# Altium schematic sheet Power_Suply.SchDoc
size A
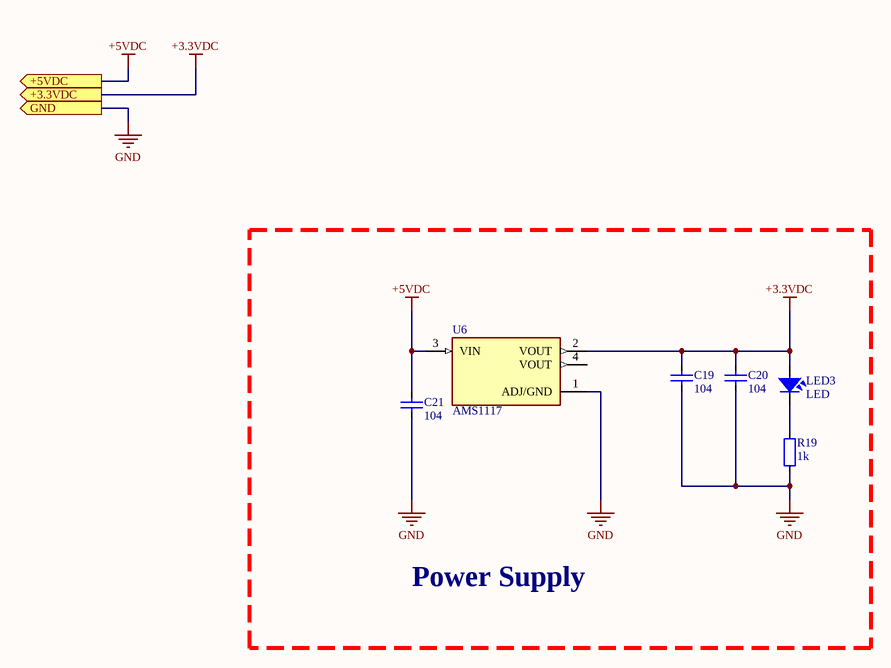
[diagram p0: Power_Suply.SchDoc]

## Parts
C19  104  [CAP_0805]
C20  104  [CAP_0805]
C21  104  [CAP_0805]
LED3  LED  [LED-0805-Red]
R19  1k  [RES-SMD-0805]
U6  AMS1117  [SOT229P700X180-4N]

## Blocks framed on the sheet
Power Supply: C19-C21 LED3 R19 U6

## Ports
+3.3VDC (out), +5VDC (out), GND (out)

## Nets
+3.3VDC: C19.2 C20.2 LED3.1 U6.2(VOUT) ; port +3.3VDC
+5VDC: C21.2 U6.3(VIN) ; port +5VDC
GND: C19.1 C20.1 C21.1 R19.1 U6.1(ADJ/GND) ; port GND
NetLED3_2: LED3.2 R19.2

Not connected (* = marked no-connect by the designer): U6 4(VOUT)

## Library data of the parts
C19-C21 = CapSMD: Capacitor; Value: 33p; Published: 8-Jun-2000; LatestRevisionDate: 17-Jul-2002; LatestRevisionNote: Re-released for DXP Platform.; PackageReference: RAD-0.3; Publisher: Altium Limited
LED3 = LED: LED Single colour Green and Red; Value: LED 3 ly Single Colour
R19 = Resistor - SMD: Resistor; Manufacturer: Generic Components; Class: Passive; Published: 08/06/2000; Publisher: Altium Hobart Technology Centre
U6 = AMS1117: 1A LOW DROPOUT VOLTAGE REGULATOR SOT-223; MF: Advanced Monolithic Systems; Price: None; Availability: Not in stock; Package: SOT-223 Seeed Technology; MP: AMS1117; Value: *; SnapEDA_Link: https://www.snapeda.com/parts/AMS1117/Advanced+Monolithic+Systems/view-part/?ref=snap; Check_prices: https://www.snapeda.com/parts/AMS1117/Advanced+Monolithic+Systems/view-part/?ref=eda